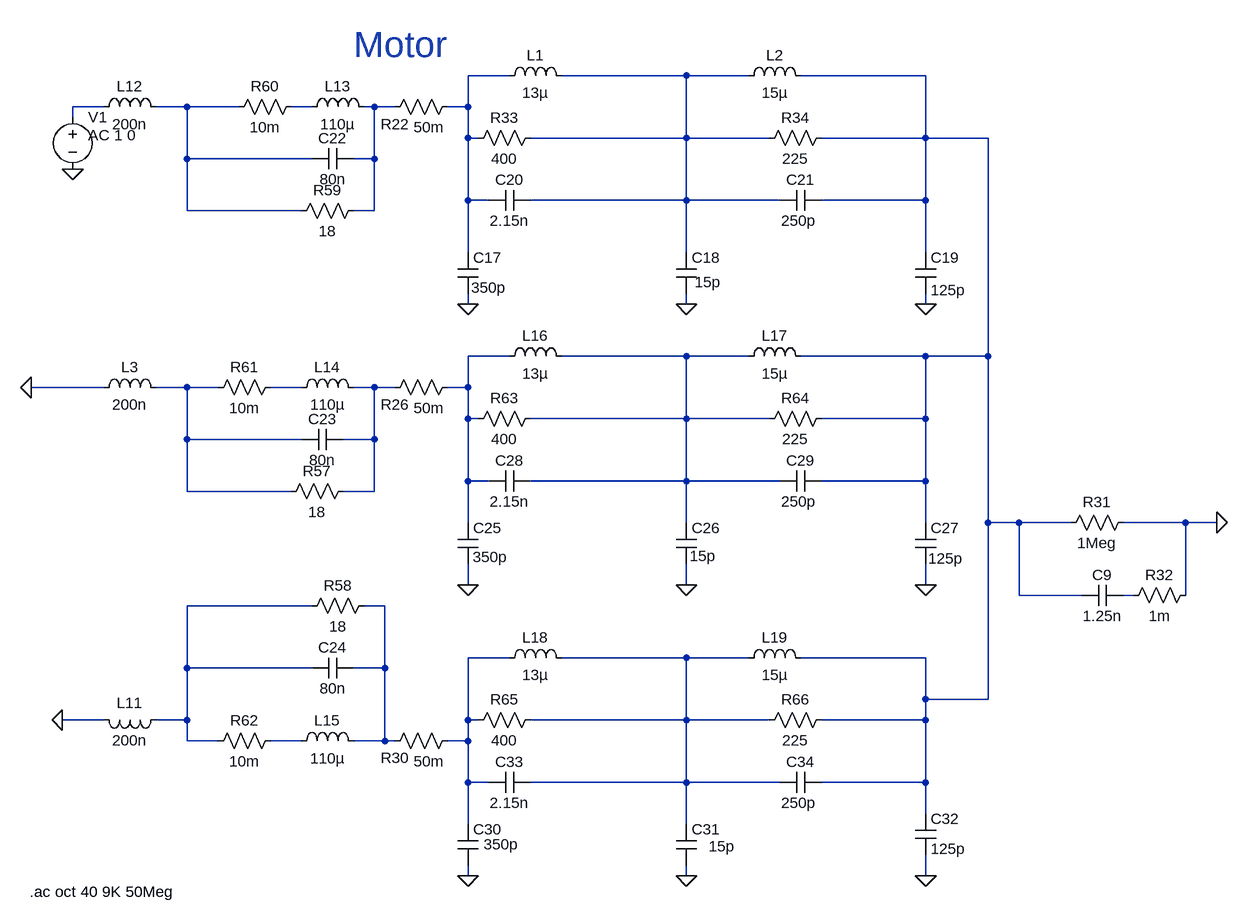
[diagram p0: schematic Motor_optimization.asc]
Motor_optimization.asc, the LTspice schematic file:
Version 4
SHEET 1 996 680
WIRE -3424 -7072 -3488 -7072
WIRE -3152 -7072 -3344 -7072
WIRE -3056 -7072 -3152 -7072
WIRE -2784 -7072 -2976 -7072
WIRE -4048 -7024 -4096 -7024
WIRE -3920 -7024 -3968 -7024
WIRE -3840 -7024 -3920 -7024
WIRE -3728 -7024 -3760 -7024
WIRE -3632 -7024 -3648 -7024
WIRE -3600 -7024 -3632 -7024
WIRE -3488 -7024 -3488 -7072
WIRE -3488 -7024 -3520 -7024
WIRE -4096 -7008 -4096 -7024
WIRE -3488 -6976 -3488 -7024
WIRE -3472 -6976 -3488 -6976
WIRE -3152 -6976 -3152 -7072
WIRE -3152 -6976 -3392 -6976
WIRE -3024 -6976 -3152 -6976
WIRE -2784 -6976 -2784 -7072
WIRE -2784 -6976 -2944 -6976
WIRE -2688 -6976 -2784 -6976
WIRE -3920 -6944 -3920 -7024
WIRE -3728 -6944 -3920 -6944
WIRE -3632 -6944 -3632 -7024
WIRE -3632 -6944 -3664 -6944
WIRE -3488 -6880 -3488 -6976
WIRE -3456 -6880 -3488 -6880
WIRE -3152 -6880 -3152 -6976
WIRE -3152 -6880 -3392 -6880
WIRE -3008 -6880 -3152 -6880
WIRE -2784 -6880 -2784 -6976
WIRE -2784 -6880 -2944 -6880
WIRE -3920 -6864 -3920 -6944
WIRE -3744 -6864 -3920 -6864
WIRE -3632 -6864 -3632 -6944
WIRE -3632 -6864 -3664 -6864
WIRE -3488 -6800 -3488 -6880
WIRE -3152 -6800 -3152 -6880
WIRE -2784 -6800 -2784 -6880
WIRE -3488 -6720 -3488 -6736
WIRE -3152 -6720 -3152 -6736
WIRE -2784 -6720 -2784 -6736
WIRE -3424 -6640 -3488 -6640
WIRE -3152 -6640 -3344 -6640
WIRE -3056 -6640 -3152 -6640
WIRE -2784 -6640 -2976 -6640
WIRE -2688 -6640 -2688 -6976
WIRE -2688 -6640 -2784 -6640
WIRE -4048 -6592 -4160 -6592
WIRE -3920 -6592 -3968 -6592
WIRE -3872 -6592 -3920 -6592
WIRE -3744 -6592 -3792 -6592
WIRE -3632 -6592 -3664 -6592
WIRE -3600 -6592 -3632 -6592
WIRE -3488 -6592 -3488 -6640
WIRE -3488 -6592 -3520 -6592
WIRE -3488 -6544 -3488 -6592
WIRE -3472 -6544 -3488 -6544
WIRE -3152 -6544 -3152 -6640
WIRE -3152 -6544 -3392 -6544
WIRE -3024 -6544 -3152 -6544
WIRE -2784 -6544 -2784 -6640
WIRE -2784 -6544 -2944 -6544
WIRE -3920 -6512 -3920 -6592
WIRE -3744 -6512 -3920 -6512
WIRE -3632 -6512 -3632 -6592
WIRE -3632 -6512 -3680 -6512
WIRE -3488 -6448 -3488 -6544
WIRE -3456 -6448 -3488 -6448
WIRE -3152 -6448 -3152 -6544
WIRE -3152 -6448 -3392 -6448
WIRE -3008 -6448 -3152 -6448
WIRE -2784 -6448 -2784 -6544
WIRE -2784 -6448 -2944 -6448
WIRE -3920 -6432 -3920 -6512
WIRE -3760 -6432 -3920 -6432
WIRE -3632 -6432 -3632 -6512
WIRE -3632 -6432 -3680 -6432
WIRE -3488 -6384 -3488 -6448
WIRE -3152 -6384 -3152 -6448
WIRE -2784 -6384 -2784 -6448
WIRE -2688 -6384 -2688 -6640
WIRE -2640 -6384 -2688 -6384
WIRE -2560 -6384 -2640 -6384
WIRE -2384 -6384 -2480 -6384
WIRE -2336 -6384 -2384 -6384
WIRE -3488 -6288 -3488 -6320
WIRE -3152 -6288 -3152 -6320
WIRE -2784 -6288 -2784 -6320
WIRE -2640 -6272 -2640 -6384
WIRE -2544 -6272 -2640 -6272
WIRE -2464 -6272 -2480 -6272
WIRE -2384 -6272 -2384 -6384
WIRE -3728 -6256 -3920 -6256
WIRE -3616 -6256 -3648 -6256
WIRE -3424 -6176 -3488 -6176
WIRE -3152 -6176 -3344 -6176
WIRE -3056 -6176 -3152 -6176
WIRE -2784 -6176 -2976 -6176
WIRE -3920 -6160 -3920 -6256
WIRE -3728 -6160 -3920 -6160
WIRE -3616 -6160 -3616 -6256
WIRE -3616 -6160 -3664 -6160
WIRE -2784 -6112 -2784 -6176
WIRE -2688 -6112 -2688 -6384
WIRE -2688 -6112 -2784 -6112
WIRE -4048 -6080 -4112 -6080
WIRE -3920 -6080 -3920 -6160
WIRE -3920 -6080 -3968 -6080
WIRE -3488 -6080 -3488 -6176
WIRE -3472 -6080 -3488 -6080
WIRE -3152 -6080 -3152 -6176
WIRE -3152 -6080 -3392 -6080
WIRE -3024 -6080 -3152 -6080
WIRE -2784 -6080 -2784 -6112
WIRE -2784 -6080 -2944 -6080
WIRE -3920 -6048 -3920 -6080
WIRE -3872 -6048 -3920 -6048
WIRE -3744 -6048 -3792 -6048
WIRE -3616 -6048 -3616 -6160
WIRE -3616 -6048 -3664 -6048
WIRE -3600 -6048 -3616 -6048
WIRE -3488 -6048 -3488 -6080
WIRE -3488 -6048 -3520 -6048
WIRE -3488 -5984 -3488 -6048
WIRE -3456 -5984 -3488 -5984
WIRE -3152 -5984 -3152 -6080
WIRE -3152 -5984 -3392 -5984
WIRE -3008 -5984 -3152 -5984
WIRE -2784 -5984 -2784 -6080
WIRE -2784 -5984 -2944 -5984
WIRE -2784 -5936 -2784 -5984
WIRE -3488 -5920 -3488 -5984
WIRE -3152 -5920 -3152 -5984
WIRE -3488 -5840 -3488 -5856
WIRE -3152 -5840 -3152 -5856
WIRE -2784 -5840 -2784 -5872
FLAG -2336 -6384 0
FLAG -3488 -6720 0
FLAG -3152 -6720 0
FLAG -2784 -6720 0
FLAG -3488 -6288 0
FLAG -3152 -6288 0
FLAG -2784 -6288 0
FLAG -3488 -5840 0
FLAG -3152 -5840 0
FLAG -2784 -5840 0
FLAG -4096 -6928 0
FLAG -4160 -6592 0
FLAG -4112 -6080 0
SYMBOL res -3504 -7040 R90
WINDOW 0 58 96 VBottom 2
WINDOW 3 32 44 VTop 2
SYMATTR InstName R22
SYMATTR Value 50m
SYMBOL res -3504 -6608 R90
WINDOW 0 58 96 VBottom 2
WINDOW 3 32 44 VTop 2
SYMATTR InstName R26
SYMATTR Value 50m
SYMBOL res -3504 -6064 R90
WINDOW 0 58 96 VBottom 2
WINDOW 3 32 44 VTop 2
SYMATTR InstName R30
SYMATTR Value 50m
SYMBOL res -2464 -6400 R90
WINDOW 0 0 56 VBottom 2
WINDOW 3 32 56 VTop 2
SYMATTR InstName R31
SYMATTR Value 1Meg
SYMBOL cap -2480 -6288 R90
WINDOW 0 0 32 VBottom 2
WINDOW 3 32 32 VTop 2
SYMATTR InstName C9
SYMATTR Value 1.25n
SYMBOL ind -3328 -7056 M270
WINDOW 0 32 56 VTop 2
WINDOW 3 5 56 VBottom 2
SYMATTR InstName L1
SYMATTR Value 13µ
SYMBOL ind -2960 -7056 M270
WINDOW 0 32 56 VTop 2
WINDOW 3 5 56 VBottom 2
SYMATTR InstName L2
SYMATTR Value 15µ
SYMBOL cap -3504 -6800 R0
WINDOW 3 21 54 Left 2
SYMATTR Value 350p
SYMATTR InstName C17
SYMBOL cap -3168 -6800 R0
WINDOW 3 29 46 Left 2
SYMATTR Value 15p
SYMATTR InstName C18
SYMBOL cap -2800 -6800 R0
WINDOW 3 24 58 Left 2
SYMATTR Value 125p
SYMATTR InstName C19
SYMBOL cap -3392 -6896 R90
WINDOW 0 0 32 VBottom 2
WINDOW 3 32 32 VTop 2
SYMATTR InstName C20
SYMATTR Value 2.15n
SYMBOL cap -2944 -6896 R90
WINDOW 0 0 32 VBottom 2
WINDOW 3 32 35 VTop 2
SYMATTR InstName C21
SYMATTR Value 250p
SYMBOL res -2368 -6288 R90
WINDOW 0 0 56 VBottom 2
WINDOW 3 32 56 VTop 2
SYMATTR InstName R32
SYMATTR Value 1m
SYMBOL res -3376 -6992 R90
WINDOW 0 0 56 VBottom 2
WINDOW 3 32 56 VTop 2
SYMATTR InstName R33
SYMATTR Value 400
SYMBOL res -2928 -6992 R90
WINDOW 0 0 56 VBottom 2
WINDOW 3 32 56 VTop 2
SYMATTR InstName R34
SYMATTR Value 225
SYMBOL ind -3952 -6576 M270
WINDOW 0 32 56 VTop 2
WINDOW 3 5 56 VBottom 2
SYMATTR InstName L3
SYMATTR Value 200n
SYMBOL ind -3952 -6096 R90
WINDOW 0 5 56 VBottom 2
WINDOW 3 32 56 VTop 2
SYMATTR InstName L11
SYMATTR Value 200n
SYMBOL ind -3952 -7008 M270
WINDOW 0 32 56 VTop 2
WINDOW 3 5 56 VBottom 2
SYMATTR InstName L12
SYMATTR Value 200n
SYMBOL ind -3744 -7008 R270
WINDOW 0 32 56 VTop 2
WINDOW 3 5 56 VBottom 2
SYMATTR InstName L13
SYMATTR Value 110µ
SYMBOL ind -3760 -6576 R270
WINDOW 0 32 56 VTop 2
WINDOW 3 5 56 VBottom 2
SYMATTR InstName L14
SYMATTR Value 110µ
SYMBOL ind -3760 -6032 R270
WINDOW 0 32 56 VTop 2
WINDOW 3 5 56 VBottom 2
SYMATTR InstName L15
SYMATTR Value 110µ
SYMBOL cap -3664 -6960 R90
WINDOW 0 0 32 VBottom 2
WINDOW 3 32 32 VTop 2
SYMATTR InstName C22
SYMATTR Value 80n
SYMBOL cap -3680 -6528 R90
WINDOW 0 0 32 VBottom 2
WINDOW 3 32 32 VTop 2
SYMATTR InstName C23
SYMATTR Value 80n
SYMBOL cap -3664 -6176 R90
WINDOW 0 0 32 VBottom 2
WINDOW 3 32 32 VTop 2
SYMATTR InstName C24
SYMATTR Value 80n
SYMBOL res -3664 -6448 R90
WINDOW 0 0 56 VBottom 2
WINDOW 3 32 56 VTop 2
SYMATTR InstName R57
SYMATTR Value 18
SYMBOL res -3632 -6272 R90
WINDOW 0 0 56 VBottom 2
WINDOW 3 32 56 VTop 2
SYMATTR InstName R58
SYMATTR Value 18
SYMBOL res -3648 -6880 R90
WINDOW 0 0 56 VBottom 2
WINDOW 3 32 56 VTop 2
SYMATTR InstName R59
SYMATTR Value 18
SYMBOL res -3744 -7040 R90
WINDOW 0 0 56 VBottom 2
WINDOW 3 32 56 VTop 2
SYMATTR InstName R60
SYMATTR Value 10m
SYMBOL res -3776 -6608 R90
WINDOW 0 0 56 VBottom 2
WINDOW 3 32 56 VTop 2
SYMATTR InstName R61
SYMATTR Value 10m
SYMBOL res -3776 -6064 R90
WINDOW 0 0 56 VBottom 2
WINDOW 3 32 56 VTop 2
SYMATTR InstName R62
SYMATTR Value 10m
SYMBOL ind -3328 -6624 M270
WINDOW 0 32 56 VTop 2
WINDOW 3 5 56 VBottom 2
SYMATTR InstName L16
SYMATTR Value 13µ
SYMBOL ind -2960 -6624 M270
WINDOW 0 32 56 VTop 2
WINDOW 3 5 56 VBottom 2
SYMATTR InstName L17
SYMATTR Value 15µ
SYMBOL cap -3504 -6384 R0
WINDOW 3 23 53 Left 2
SYMATTR Value 350p
SYMATTR InstName C25
SYMBOL cap -3168 -6384 R0
WINDOW 3 21 51 Left 2
SYMATTR Value 15p
SYMATTR InstName C26
SYMBOL cap -2800 -6384 R0
WINDOW 3 20 55 Left 2
SYMATTR Value 125p
SYMATTR InstName C27
SYMBOL cap -3392 -6464 R90
WINDOW 0 0 32 VBottom 2
WINDOW 3 32 32 VTop 2
SYMATTR InstName C28
SYMATTR Value 2.15n
SYMBOL cap -2944 -6464 R90
WINDOW 0 0 32 VBottom 2
WINDOW 3 32 35 VTop 2
SYMATTR InstName C29
SYMATTR Value 250p
SYMBOL res -3376 -6560 R90
WINDOW 0 0 56 VBottom 2
WINDOW 3 32 56 VTop 2
SYMATTR InstName R63
SYMATTR Value 400
SYMBOL res -2928 -6560 R90
WINDOW 0 0 56 VBottom 2
WINDOW 3 32 56 VTop 2
SYMATTR InstName R64
SYMATTR Value 225
SYMBOL ind -3328 -6160 M270
WINDOW 0 32 56 VTop 2
WINDOW 3 5 56 VBottom 2
SYMATTR InstName L18
SYMATTR Value 13µ
SYMBOL ind -2960 -6160 M270
WINDOW 0 32 56 VTop 2
WINDOW 3 5 56 VBottom 2
SYMATTR InstName L19
SYMATTR Value 15µ
SYMBOL cap -3504 -5920 R0
WINDOW 3 40 31 Left 2
SYMATTR Value 350p
SYMATTR InstName C30
SYMBOL cap -3168 -5920 R0
WINDOW 3 50 34 Left 2
SYMATTR Value 15p
SYMATTR InstName C31
SYMBOL cap -2800 -5936 R0
WINDOW 3 24 54 Left 2
SYMATTR Value 125p
SYMATTR InstName C32
SYMBOL cap -3392 -6000 R90
WINDOW 0 0 32 VBottom 2
WINDOW 3 32 32 VTop 2
SYMATTR InstName C33
SYMATTR Value 2.15n
SYMBOL cap -2944 -6000 R90
WINDOW 0 0 32 VBottom 2
WINDOW 3 32 35 VTop 2
SYMATTR InstName C34
SYMATTR Value 250p
SYMBOL res -3376 -6096 R90
WINDOW 0 0 56 VBottom 2
WINDOW 3 32 56 VTop 2
SYMATTR InstName R65
SYMATTR Value 400
SYMBOL res -2928 -6096 R90
WINDOW 0 0 56 VBottom 2
WINDOW 3 32 56 VTop 2
SYMATTR InstName R66
SYMATTR Value 225
SYMBOL voltage -4096 -7024 R0
WINDOW 123 24 44 Left 2
WINDOW 39 0 0 Left 2
SYMATTR InstName V1
SYMATTR Value ""
SYMATTR Value2 AC 1 0
TEXT -3664 -7120 Left 5 ;Motor
TEXT -4162 -5816 Left 2 !.ac oct 40 9K 50Meg

The netlist it stands for:
* Motor_optimization.asc
R22 N001 N007 50m
R26 N008 N012 50m
R30 N016 N015 50m
R31 0 N003 1Meg
C9 N013 N003 1.25n
L1 N002 N001 13µ
L2 N003 N002 15µ
C17 N001 0 350p
C18 N002 0 15p
C19 N003 0 125p
C20 N002 N001 2.15n
C21 N003 N002 250p
R32 0 N013 1m
R33 N002 N001 400
R34 N003 N002 225
L3 N010 0 200n
L11 N014 0 200n
L12 N005 N004 200n
L13 N006 N007 110µ
L14 N011 N012 110µ
L15 N018 N015 110µ
C22 N007 N005 80n
C23 N012 N010 80n
C24 N015 N014 80n
R57 N012 N010 18
R58 N015 N014 18
R59 N007 N005 18
R60 N006 N005 10m
R61 N011 N010 10m
R62 N018 N014 10m
L16 N009 N008 13µ
L17 N003 N009 15µ
C25 N008 0 350p
C26 N009 0 15p
C27 N003 0 125p
C28 N009 N008 2.15n
C29 N003 N009 250p
R63 N009 N008 400
R64 N003 N009 225
L18 N017 N016 13µ
L19 N003 N017 15µ
C30 N016 0 350p
C31 N017 0 15p
C32 N003 0 125p
C33 N017 N016 2.15n
C34 N003 N017 250p
R65 N017 N016 400
R66 N003 N017 225
V1 N004 0 AC 1 0
* Motor
.ac oct 40 9K 50Meg
.backanno
.end